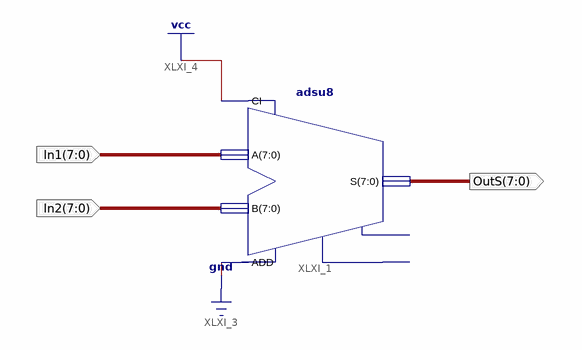
[diagram p0: schematic sheet 1]
// Xilinx ISE schematic Sub.sch (spartan6) as structural Verilog: 1 symbols, 3 ports
module Sub (
  input  [7:0] In1,
  input  [7:0] In2,
  output [7:0] OutS
);

  adsu8 XLXI_1 (.A(In1), .ADD(1'b0), .B(In2), .CI(1'b1), .S(OutS));  // open: CO, OFL
endmodule
